# Altium schematic sheet PID_Controlling_Unit.SchDoc: PID Controller Unit
size Letter; Date: 12/18/2022; DrawnBy: Pramuditha A.A.H.; Engineer: Pramuditha A.A.H.; Revision: Project 3.1; SheetNumber: 1; SheetTotal: 1; Time: 18.16 PM
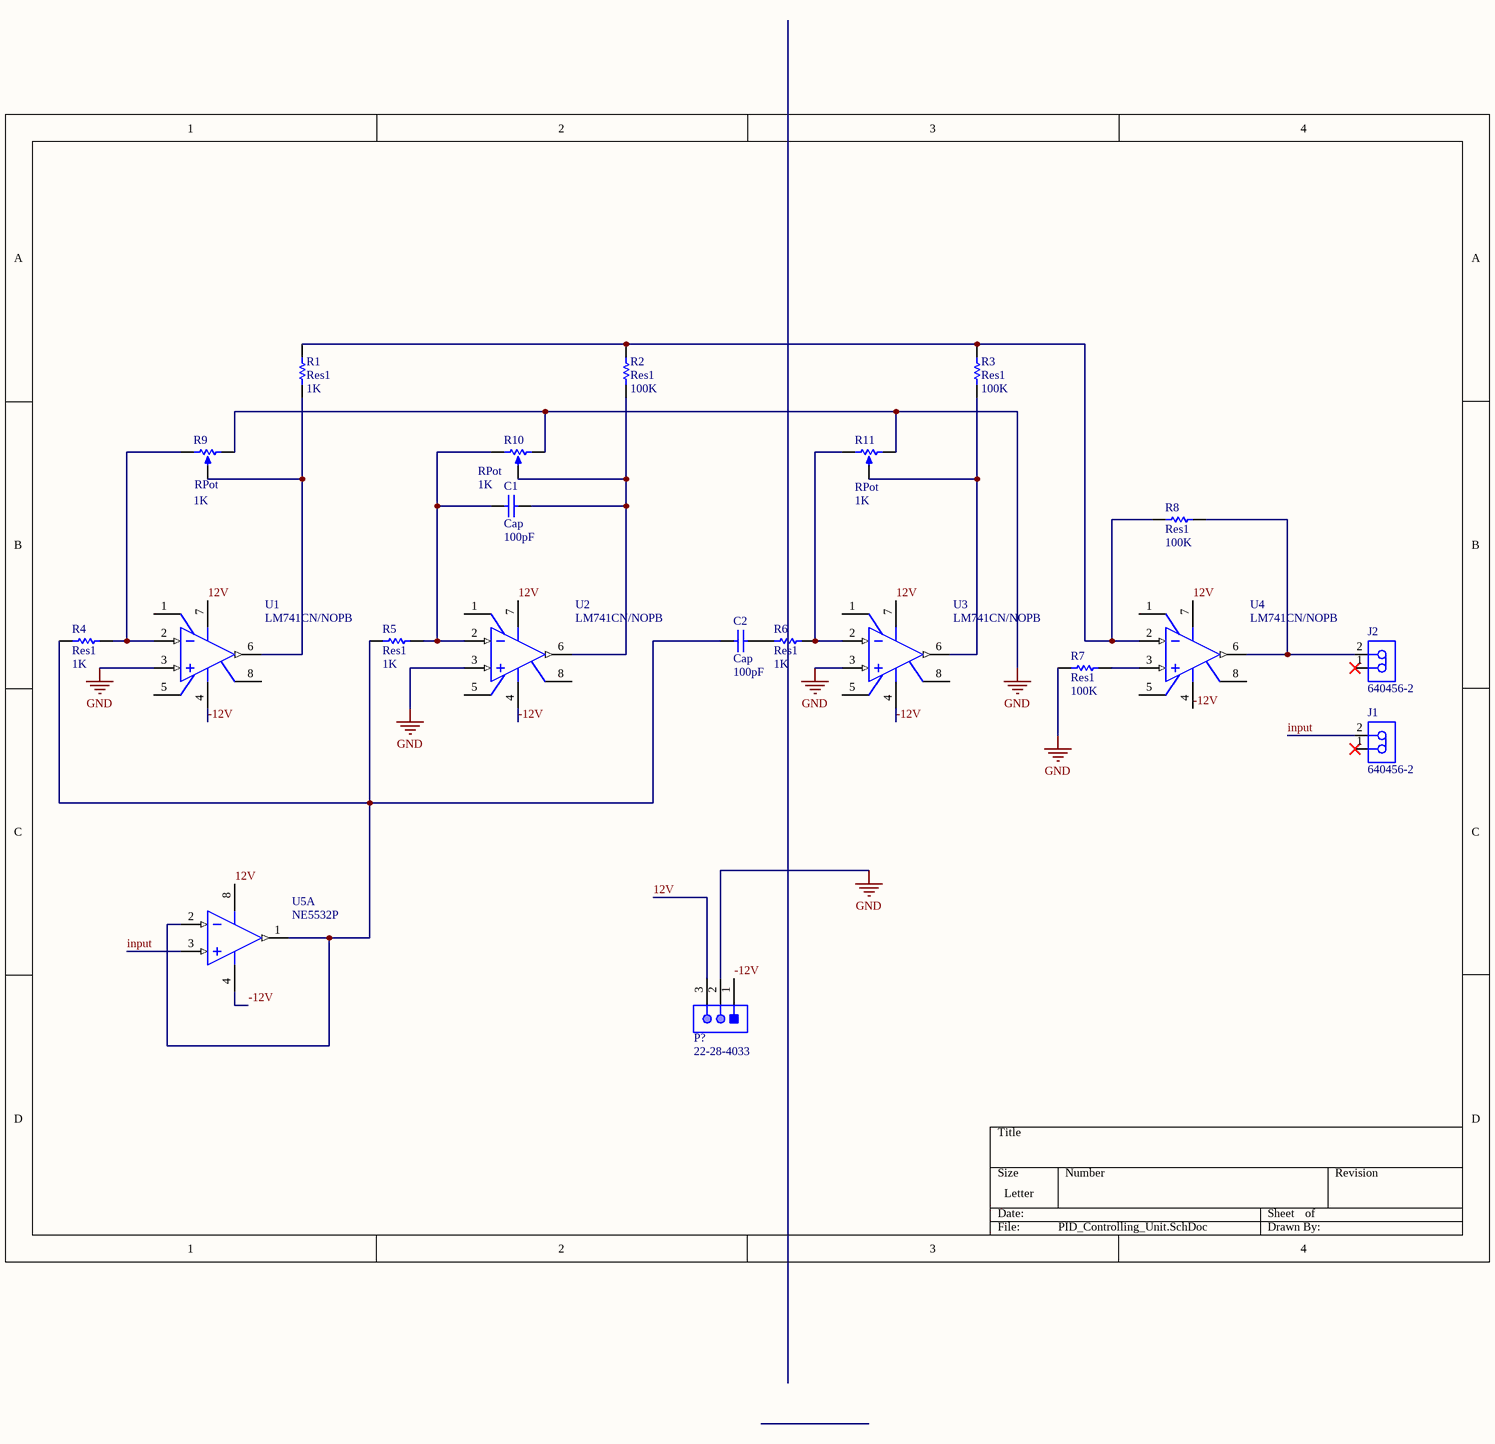
[diagram p0: PID_Controlling_Unit.SchDoc]

## Parts
C1  Cap  value 100pF  [RAD-0.3]
C2  Cap  value 100pF  [RAD-0.3]
J1  640456-2  [TECO-640456-2_V]
J2  640456-2  [TECO-640456-2_V]
P?  22-28-4033  [MOLX-22-28-4033_V]
R1  Res1  value 1K  [AXIAL-0.3]
R2  Res1  value 100K  [AXIAL-0.3]
R3  Res1  value 100K  [AXIAL-0.3]
R4  Res1  value 1K  [AXIAL-0.3]
R5  Res1  value 1K  [AXIAL-0.3]
R6  Res1  value 1K  [AXIAL-0.3]
R7  Res1  value 100K  [AXIAL-0.3]
R8  Res1  value 100K  [AXIAL-0.3]
R9  RPot  value 1K  [VR5]
R10  RPot  value 1K  [VR5]
R11  RPot  value 1K  [VR5]
U1  LM741CN/NOPB  [P0008A]
U2  LM741CN/NOPB  [P0008A]
U3  LM741CN/NOPB  [P0008A]
U4  LM741CN/NOPB  [P0008A]
U5  NE5532P  [P0008A]  (part A of 2)

## Nets
GND: P?.2 R7.1 R9.2(BOT) R10.2(BOT) R11.2(BOT) U1.3(IN+) U2.3(IN+) U3.3(IN+)
12V: P?.3 U1.7(V+) U2.7(V+) U3.7(V+) U4.7(V+) U5.8(VCC+)
-12V: P?.1 U1.4(V-) U2.4(V-) U3.4(V-) U4.4(V-) U5.4(VCC-)
input: J1.2 U5.3(IN1+)
NetC1_1: C1.1 R5.2 R10.1(TOP) U2.2(IN-)
NetC1_2: C1.2 R2.1 R10.3(TAP) U2.6(OUT)
NetC2_1: C2.1 R4.1 R5.1 U5.1(OUT1) U5.2(IN1-)
NetC2_2: C2.2 R6.1
NetJ2_2: J2.2 R8.2 U4.6(OUT)
NetR1_1: R1.1 R9.3(TAP) U1.6(OUT)
NetR1_2: R1.2 R2.2 R3.2 R8.1 U4.2(IN-)
NetR3_1: R3.1 R11.3(TAP) U3.6(OUT)
NetR4_2: R4.2 R9.1(TOP) U1.2(IN-)
NetR6_2: R6.2 R11.1(TOP) U3.2(IN-)
NetR7_2: R7.2 U4.3(IN+)

Not connected (* = marked no-connect by the designer): J1 1*; J2 1*; U1 1(OFS_NULL) 5(OFS_NULL) 8(NC); U2 1(OFS_NULL) 5(OFS_NULL) 8(NC); U3 1(OFS_NULL) 5(OFS_NULL) 8(NC); U4 1(OFS_NULL) 5(OFS_NULL) 8(NC)

## Library data of the parts
C1 C2 = Cap: Capacitor; Published: 8-Jun-2000; LatestRevisionDate: 17-Jul-2002; LatestRevisionNote: Re-released for DXP Platform.; PackageReference: RAD-0.3; Publisher: Altium Limited; PackageDescription: Radial Cap, Thru-Hole; 2 Leads; 0.3 in Pin Spacing
J1 J2 = CMP-2000-05417-1: Male Header, Pitch 2.54 mm, 1 x 2 Position, Height 10.49 mm, Tail Length 3.556 mm, -55 to 105 degC, RoHS, Bulk; Manufacturer: TE Connectivity; Standards: RoHSCompliant,ELVCompliant,UL94V-0; Material, Housing: Polyester; Agency Approvals: CSA,UL; Brand/Series: MTA-100Series; Contact Centerline Spacing: 0.100 / in.; Material, Contact: CopperAlloy; Current, Rating: 5 / A; Color, Housing: White; Contact Termination Area Plating: Tin; Special Features: Pinstrip; Number of Positions: 2; Pin Spacing: 0.1 / "; Temperature, Operating: -55to+105 / degC; Angle: Straight; Mount Angle: Vertical; Connector Type: MTA-100; Primary Type: InterconnectSystem; Voltage, Rating: 250 / V; Mounting Hole Size: 0.04 / "; Number of Rows: 1; Termination: Solder; Length, Terminal Post: 0.14 / in.; Manufacturer URL: http://www.te.com/; Color: White; Size, Post: 0.025 / in.; Contact Shape: Square; Mounting Type: PCMount; Datasheet URL: https://datasheet.ciiva.com/11746/0900766b80eb7fdd-11746365.pdf; Type: PCBPlug; Datasheet Version: Rev. W, 06/2004; Number of Contacts: 2; Flammability Rating: UL94V-0; Contact Plating: Tin; Length, Pin: 0.14 / "; Contact Mating Area Plating: Tin; Length, Overall: 0.2 / "
P? = CMP-1676-00001-5: Male Header, Pitch 2.54 mm, 1 x 3 Position, Height 8.38 mm, Tail Length 3.18 mm, RoHS, Bulk; Manufacturer: Molex; Rows: 1; Voltage Rating: 250 V; Current Rating: 4 A; Min Operating Temperature: 0 degC; Lead Pitch: 0.1 inch; Packaging: Bulk; Contact Finish: Gold; RoHSCompliant: true; Contact Material: Brass; PackageReference: 22-28-4033; REACH SVHC: Unknown; PackageDescription: Male Header, Pitch 2.54 mm, 1 x 3 Position, Height 8.38 mm, Tail Length 3.18 mm; ComponentLink2URL: http://www.molex.com/pdm_docs/sd/022284033_sd.pdf; Height: 8.38 mm; Mounting Technology: Through Hole; ComponentLink1Description: Manufacturer URL; Length: 7.62 mm; Mount: Through Hole; DatasheetVersion: Rev. G, 01/2012; Max Operating Temperature: 75 degC; ComponentLink2Description: Datasheet; Colour: Black; Pins: 3; Contact Plating: Gold; Package Quantity: 1; ComponentLink1URL: http://www.molex.com/
R1-R8 = Res1: Resistor; Published: 8-Jun-2000; LatestRevisionDate: 17-Jul-2002; LatestRevisionNote: Re-released for DXP Platform.; PackageReference: AXIAL-0.3; Publisher: Altium Limited; PackageDescription: Axial Device, Thru-Hole; 2 Leads; 0.3 in Pin Spacing
R9-R11 = RPot: Potentiometer; Sim Note: Enter the Resistance value and the set point into parameter fields.; Set Position: 0.5; Published: 8-Jun-2000; LatestRevisionDate: 17-Jul-2002; LatestRevisionNote: Re-released for DXP Platform.; PackageReference: VR5; Publisher: Altium Limited; PackageDescription: Variable Resistor, Thru-Hole; 3 Leads
U1-U4 = CMP-0055-00162-3: Operational Amplifier, 8-pin MDIP, Pb-Free; Manufacturer: Texas Instruments; PackageTopMarking: NSUZXYTTE#*LM*741CN; PowerWise: N; CompType: Amplifiers; ComponentLink1Description: Datasheet URL; ComponentLink1URL: http://www.ti.com/general/docs/lit/getliterature.tsp?genericPartNumber=LM741&fileType=pdf; PackageDescription: MDIP, .365 x .250 x .130in, 8 Lead, .100in Pitch; RoHS: Y; PinCount: 8; Code_JEDEC: MS-001-BA; Package Reference: P0008A
U5 = CMP-0017-00910-2: Dual Low-Noise High-Speed Audio Operational Amplifier, 10 to 30 V, 0 to 70 degC, 8-pin DIP (P8), Pb-Free (RoHS); Manufacturer: Texas Instruments; Iq per channel(Max)(mA): 4; Slew Rate(Typ)(V/us): 9; Vn at 1kHz(Typ)(nV/rtHz): 5; IIB(Max)(pA): 800000; Total Supply Voltage(Max)(+5V is 5, +/-5V is 10): 30; GBW(Typ)(MHz): 10; CMRR(Min)(dB): 70; Number of Channels: 2; Sub Family: General Purpose Amplifier, High Supply Voltage Amplifier (>=30V), Low Noise Amp (<=10nV/rtHz); ComponentLink2URL: http://www.ti.com/lit/ds/symlink/ne5532.pdf; PackageReference: P0008A; PackageDescription: 8-Pin Plastic In-Line, Body 9.59 x 6.35 mm, Pitch 2.54 mm; ComponentLink1Description: Manufacturer URL; Eco-Plan: Pb-Free (RoHS); Mounting Technology: Through Hole; Code_JEDEC: MS-001; PackageVersion: 4040082/E, 04/2010; DatasheetVersion: SLOS075I; ComponentLink3URL: http://www.ti.com/litv/pdf/mpdi001b; ComponentLink2Description: Datasheet; Vio (25C)(Max)(mV): 4; PartNumber: NE5532P; ComponentLink3Description: Package Specification; Total Supply Voltage(Min)(+5V is 5, +/-5V is 10): 10; ComponentLink1URL: http://www.ti.com/